# EAGLE schematic Power Supply Slow Start (EAGLE 7.1.0)
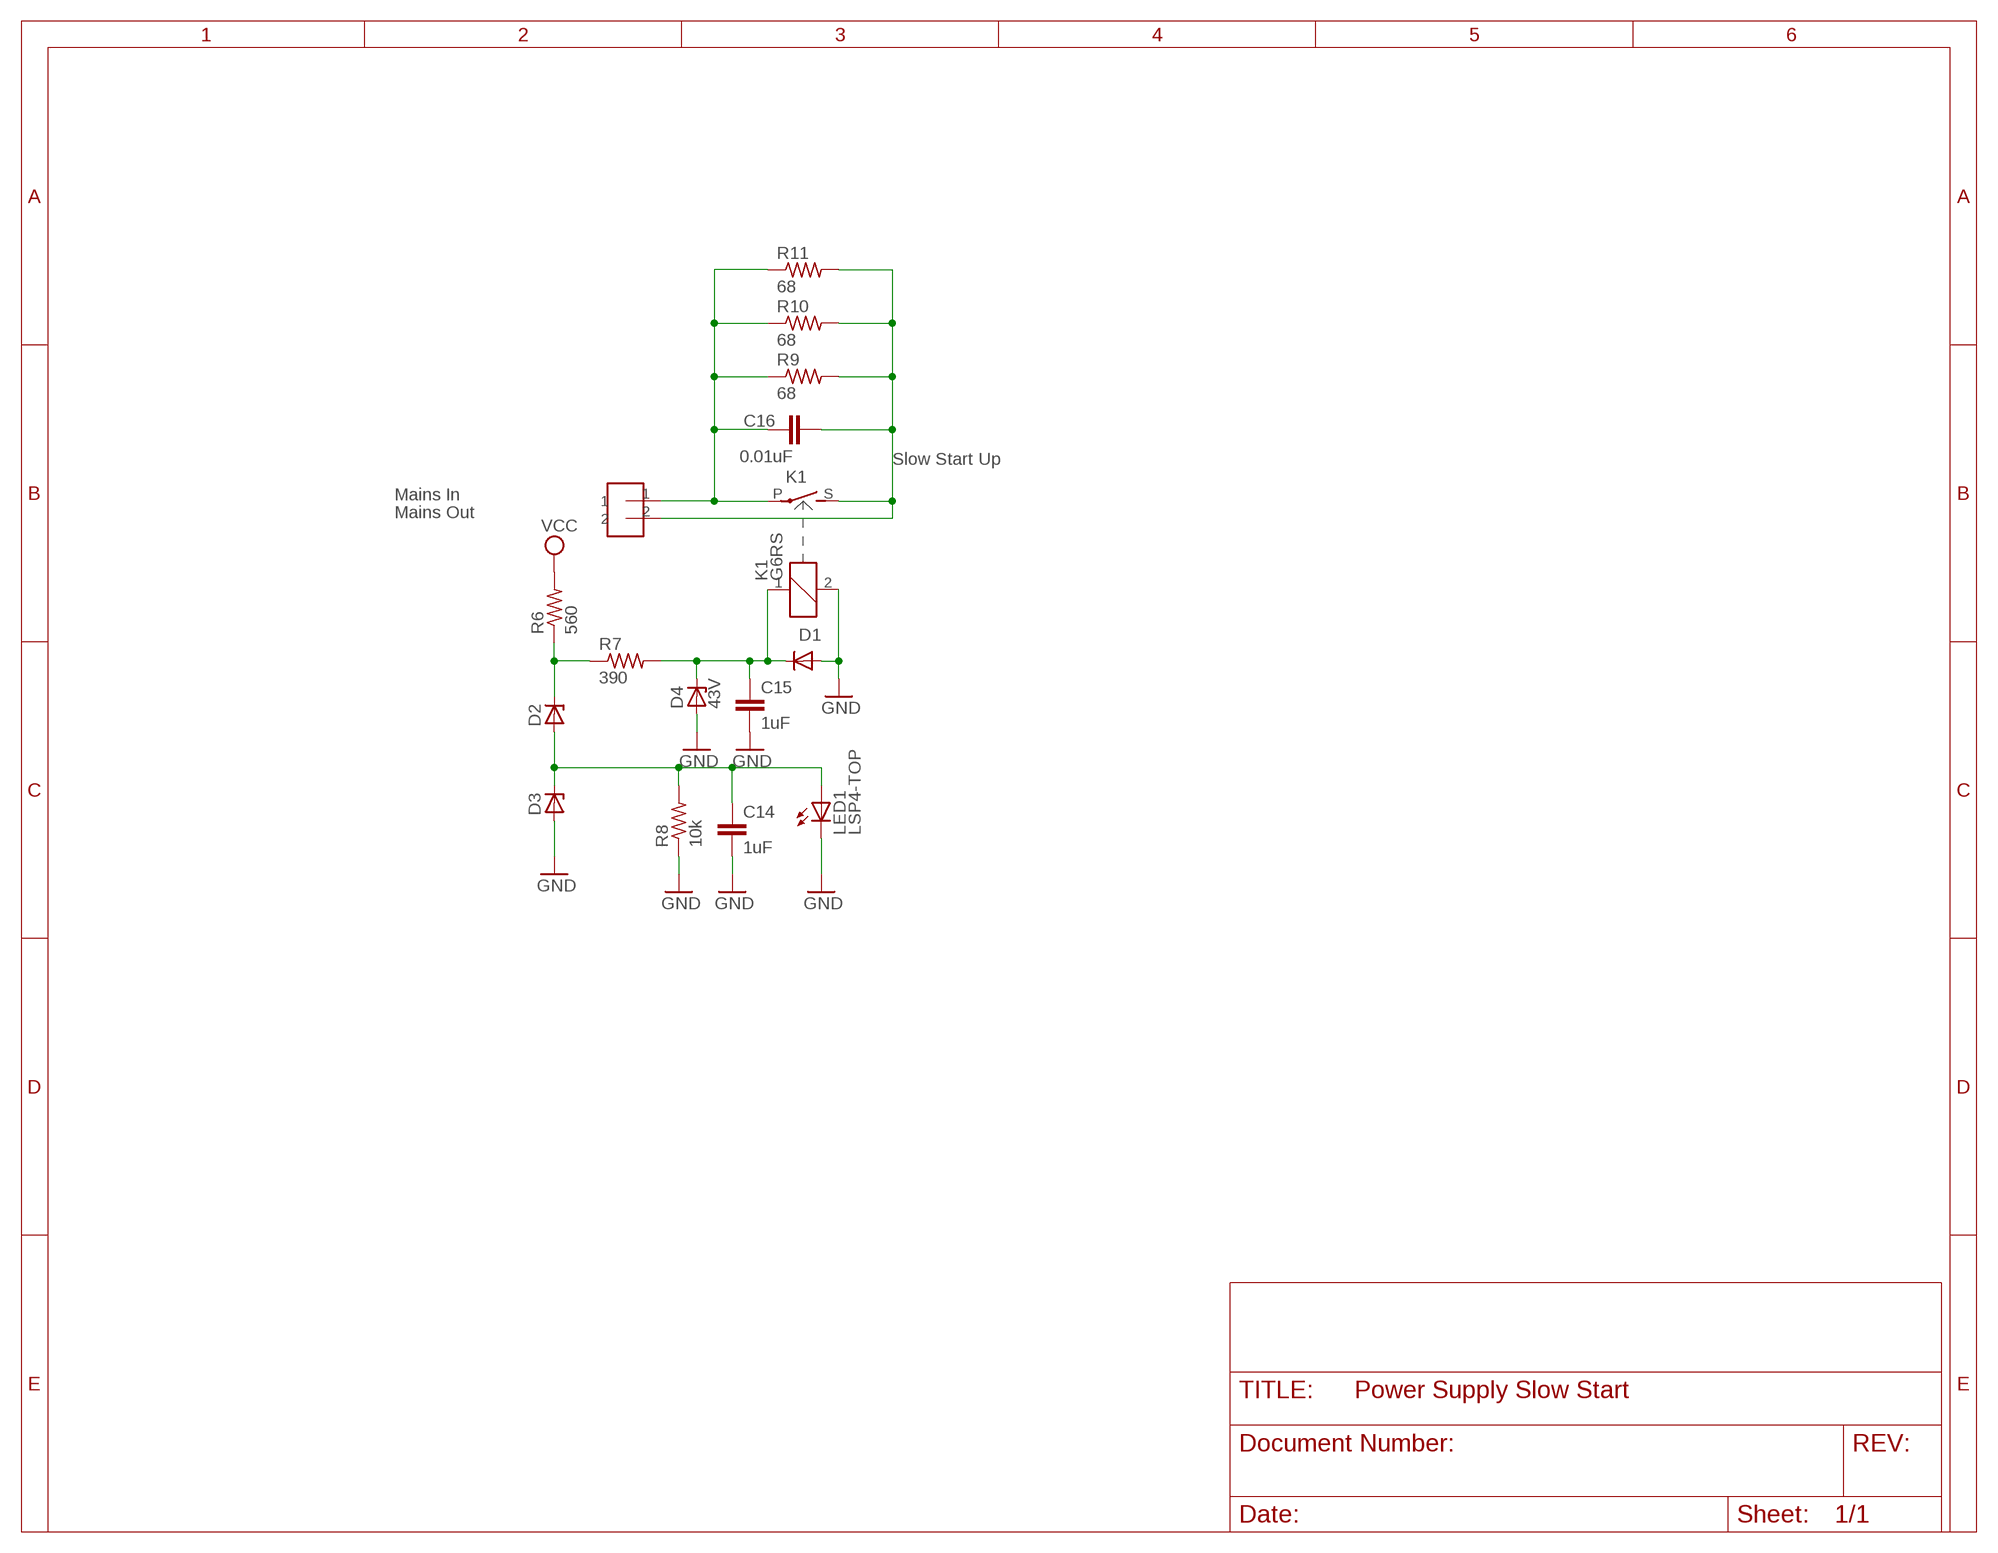
[diagram p0: schematic, sheet 1]

## Parts
C14  1uF  C-EU025-060X050  [C025-060X050]
C15  1uF  C-EU025-060X050  [C025-060X050]
C16  0.01uF  C-EU025-060X050  [C025-060X050]
D1  1N4004  [DO41-10]
D2  ZENER-DIODEDO34-7  [DO34Z7]
D3  ZENER-DIODEDO34-7  [DO34Z7]
D4  43V  ZENER-DIODEDO34-7  [DO34Z7]
K1  G6RS  [G6RS]
LED1  LSP4-TOP  [P47F-TOP]
R6  560  R-US_0617/22  [0617/22]
R7  390  R-US_0617/22  [0617/22]
R8  10k  R-US_0617/22  [0617/22]
R9  68  R-US_0617/22  [0617/22]
R10  68  R-US_0617/22  [0617/22]
R11  68  R-US_0617/22  [0617/22]
U$4  1X2HEADER_100MIL  [1X2_100MIL]

## Nets
GND: C14.2 C15.2 D1.A D3.A D4.A K1.2 LED1.C R8.1
N$3: C16.1 K1.P(2:P) R9.1 R10.1 R11.1 U$4.1
N$8: C16.2 K1.S(2:S) R9.2 R10.2 R11.2 U$4.2
N$10: C15.1 D1.C D4.C K1.1 R7.2
N$11: D2.C R6.1 R7.1
N$12: C14.1 D2.A D3.C LED1.A R8.2
VCC: R6.2

## Notes on the sheet
- Slow Start Up
- Mains In
- Mains Out

## Library data of the parts
C14-C16 = rcl:C-EU: CAPACITOR, European symbol
D1 = diode:1N4004: DIODE general purpose rectifier, 1 A
D2-D4 = diode:ZENER-DIODE: Z-Diode
K1 = relay:G6RS: RELAY 1 x norm. open, Omron; OC_FARNELL: unknown; OC_NEWARK: unknown
LED1 = led:*P4: PointLED® Enhanced Thinfilm LED TOP & BOTTOM mount LS P47F, LR P47F, LA P47F, LY P47F, LT P4SG, LB P4SG, LW P4SG Source: http://catalog.osram-os.com .. LA_LR_LS_LY_P47F_Pb_free.pdf
R6-R11 = rcl:R-US_: RESISTOR, American symbol
U$4 = Headers:1X2HEADER_100MIL